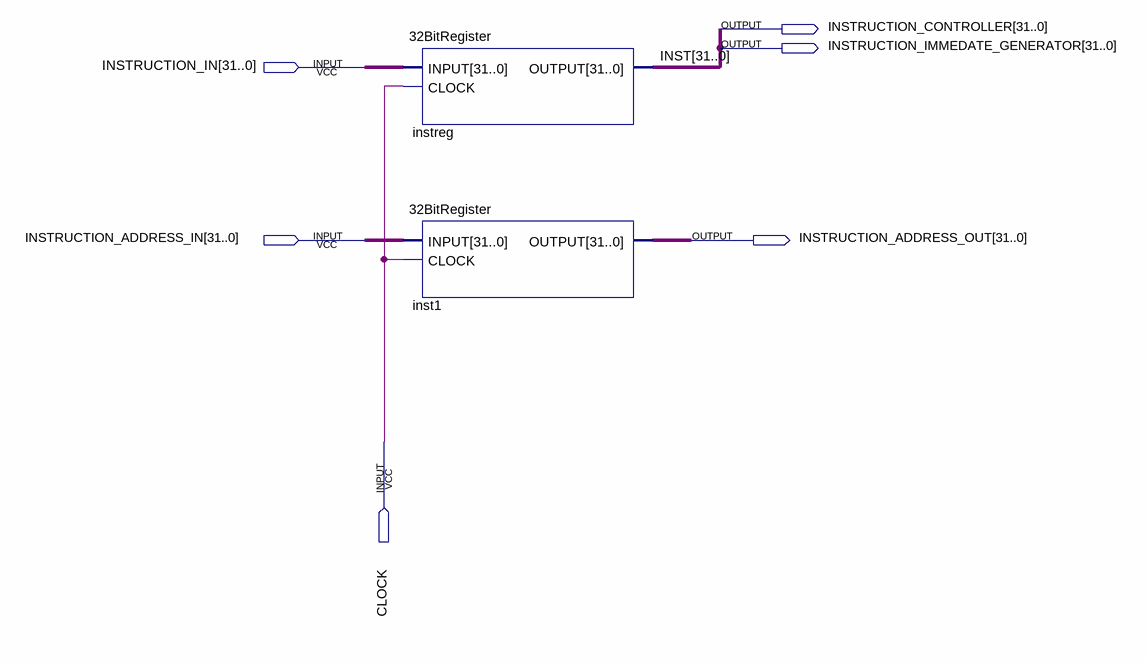
[diagram p0: schematic sheet]
// Quartus schematic FETCH_DECODE.bdf as structural Verilog: 2 symbols, 6 pins
module FETCH_DECODE (
  input  [31:0] INSTRUCTION_IN,
  input  [31:0] INSTRUCTION_ADDRESS_IN,
  input  CLOCK,
  output [31:0] INSTRUCTION_CONTROLLER,
  output [31:0] INSTRUCTION_IMMEDATE_GENERATOR,
  output [31:0] INSTRUCTION_ADDRESS_OUT
);

  \32BitRegister  instreg (.INPUT(INSTRUCTION_IN), .CLOCK(CLOCK), .OUTPUT(INSTRUCTION_CONTROLLER));
  \32BitRegister  inst1 (.INPUT(INSTRUCTION_ADDRESS_IN), .CLOCK(CLOCK), .OUTPUT(INSTRUCTION_ADDRESS_OUT));

  assign INSTRUCTION_IMMEDATE_GENERATOR = INSTRUCTION_CONTROLLER;

  // Other names for the same wires on the sheet: INST[31:0] = INSTRUCTION_CONTROLLER
endmodule
